# Altium schematic sheet Butterwoth_FIlter_8th_Order_Active.SchDoc
size A
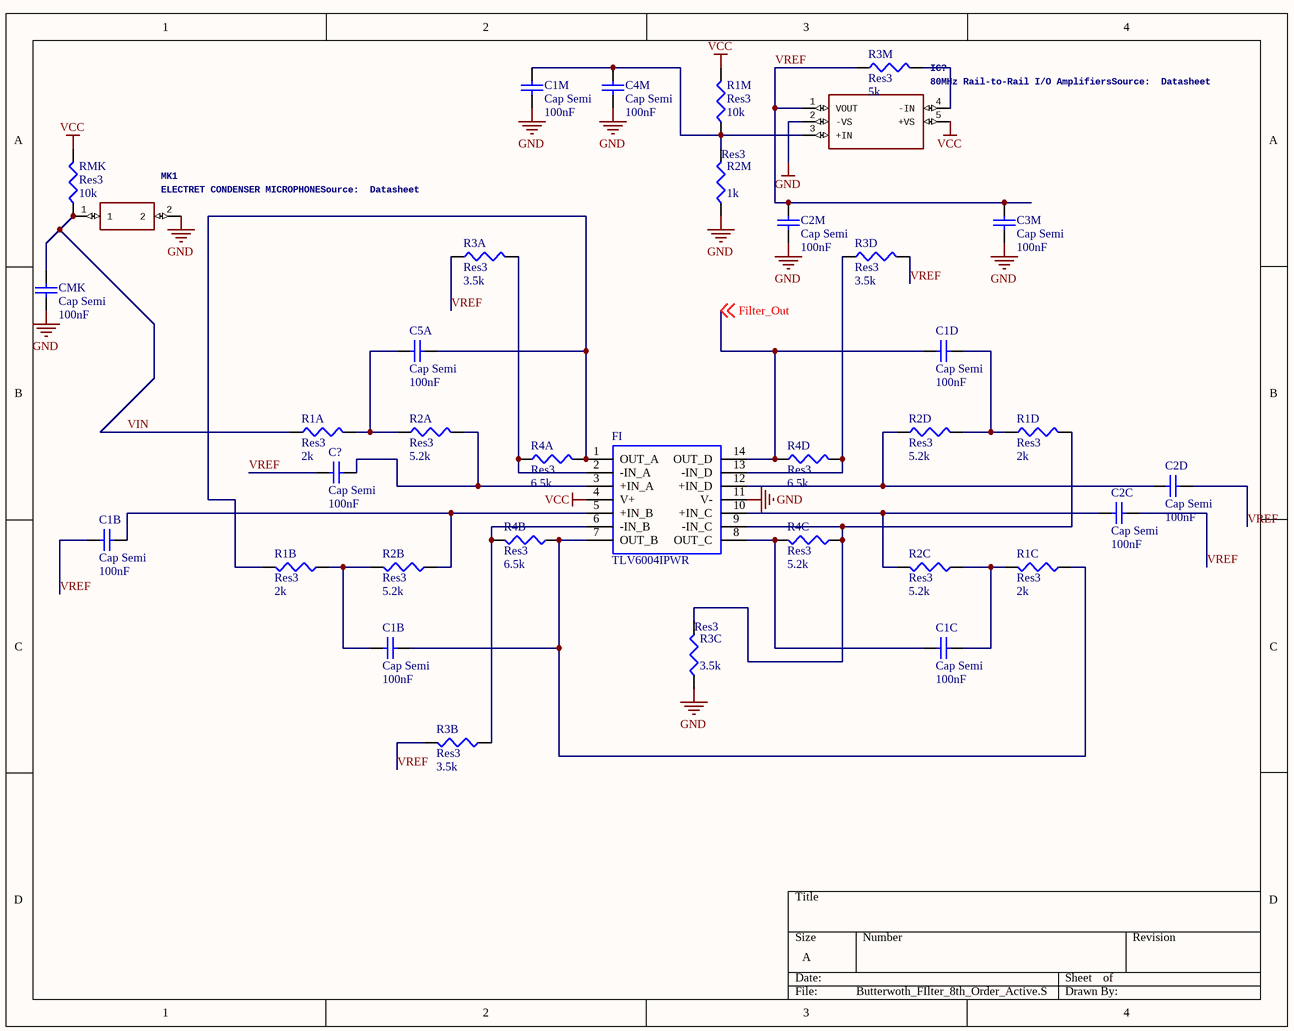
[diagram p0: Butterwoth_FIlter_8th_Order_Active.SchDoc]

## Parts
(Parts that share a designator on the sheet are numbered #1, #2 ... from top to bottom, then left to right.)
C1B#1  Cap Semi  value 100nF  [1608[0603]]
C1B#2  Cap Semi  value 100nF  [1608[0603]]
C1C  Cap Semi  value 100nF  [1608[0603]]
C1D  Cap Semi  value 100nF  [1608[0603]]
C1M  Cap Semi  value 100nF  [1608[0603]]
C2C  Cap Semi  value 100nF  [1608[0603]]
C2D  Cap Semi  value 100nF  [1608[0603]]
C2M  Cap Semi  value 100nF  [1608[0603]]
C3M  Cap Semi  value 100nF  [1608[0603]]
C4M  Cap Semi  value 100nF  [1608[0603]]
C5A  Cap Semi  value 100nF  [1608[0603]]
C?  Cap Semi  value 100nF  [1608[0603]]
CMK  Cap Semi  value 100nF  [1608[0603]]
FI  TLV6004IPWR  [SOP65P640X120-14N]
IC?  80MHz Rail-to-Rail I/O AmplifiersSource:  Datasheet  [SOT95P290X145-5N]
MK1  ELECTRET CONDENSER MICROPHONESource:  Datasheet  [CMA-4544PF-W]
R1A  Res3  value 2k  [J1-0603]
R1B  Res3  value 2k  [J1-0603]
R1C  Res3  value 2k  [J1-0603]
R1D  Res3  value 2k  [J1-0603]
R1M  Res3  value 10k  [J1-0603]
R2A  Res3  value 5.2k  [J1-0603]
R2B  Res3  value 5.2k  [J1-0603]
R2C  Res3  value 5.2k  [J1-0603]
R2D  Res3  value 5.2k  [J1-0603]
R2M  Res3  value 1k  [J1-0603]
R3A  Res3  value 3.5k  [J1-0603]
R3B  Res3  value 3.5k  [J1-0603]
R3C  Res3  value 3.5k  [J1-0603]
R3D  Res3  value 3.5k  [J1-0603]
R3M  Res3  value 5k  [J1-0603]
R4A  Res3  value 6.5k  [J1-0603]
R4B  Res3  value 6.5k  [J1-0603]
R4C  Res3  value 5.2k  [J1-0603]
R4D  Res3  value 6.5k  [J1-0603]
RMK  Res3  value 10k  [J1-0603]

## Nets
GND: C1M.1 C2M.1 C3M.1 C4M.1 CMK.1 FI.11(V-) IC?.2(-VS) MK1.2 R2M.2 R3C.2
VCC: FI.4(V+) IC?.5(+VS) R1M.1 RMK.1
Filter_Out: C1D.2 FI.14(OUT_D) R4D.2 ; off-sheet Filter_Out
VIN: CMK.2 MK1.1 R1A.1 RMK.2
VREF: C1B#1.1 C2C.2 C2D.2 C2M.2 C3M.2 C?.1 IC?.1(VOUT) R3A.1 R3B.1 R3D.1 R3M.2
NetC1B#1_2: C1B#1.2 FI.5(+IN_B) R2B.2
NetC1B#2_1: C1B#2.1 R1B.2 R2B.1
NetC1B#2_2: C1B#2.2 FI.7(OUT_B) R1C.1 R4B.2
NetC1C_1: C1C.1 R1C.2 R2C.1
NetC1C_2: C1C.2 FI.8(OUT_C) R4C.2
NetC1D_1: C1D.1 R1D.2 R2D.1
NetC1M_2: C1M.2 C4M.2 IC?.3(+IN) R1M.2 R2M.1
NetC2C_1: C2C.1 FI.10(+IN_C) R2C.2
NetC2D_1: C2D.1 FI.12(+IN_D) R2D.2
NetC5A_1: C5A.1 R1A.2 R2A.1
NetC5A_2: C5A.2 FI.1(OUT_A) R1B.1 R4A.2
NetC?_2: C?.2 FI.3(+IN_A) R2A.2
NetFI_2: FI.2(-IN_A) R3A.2 R4A.1
NetFI_6: FI.6(-IN_B) R3B.2 R4B.1
NetFI_9: FI.9(-IN_C) R1D.1 R3C.1 R4C.1
NetFI_13: FI.13(-IN_D) R3D.2 R4D.1
NetIC?_4: IC?.4(-IN) R3M.1

## Library data of the parts
C1B#1 C1B#2 C1C C1D C1M C2C C2D C2M C3M C4M C5A C? CMK = Cap Semi: Capacitor (Semiconductor SIM Model); Published: 8-Jun-2000; LatestRevisionDate: 29-May-2009; LatestRevisionNote: IPC-7351 Footprint Added.; PackageReference: C1206; Publisher: Altium Limited; PackageDescription: Chip Capacitor
FI = TLV6004IPWR: Operational Amplifiers - Op Amps 1-MHz, Low-Power Operational Amplifier for Cost-Sensitive Systems 14-TSSOP -40 to 125; Manufacturer_Name: Texas Instruments; Geometry.Height: 1.2mm; TI store Part Number: TLV6004IPWR; Manufacturer_Part_Number: TLV6004IPWR; Datasheet Link: http://www.ti.com/lit/gpn/tlv6004
IC? = AD8031ARTZ-REEL7: Manufacturer_Name: Analog Devices; GateName_1: G$1; SymbolName_1: AD8031ARTZ-REEL7; LibraryName: AD8031ARTZ-REEL7; DeviceSetName: AD8031ARTZ-REEL7; Package: SOT95P290X145-5N; Manufacturer_Part_Number: AD8031ARTZ-REEL7; Arrow_Part_Number: AD8031ARTZ-REEL7; Arrow_Price-Stock: https://www.arrow.com/en/products/ad8031artz-reel7/analog-devices; Height: mm
MK1 = CMA-4544PF-W: Manufacturer_Name: CUI; GateName_1: G$1; SymbolName_1: CMA-4544PF-W; LibraryName: CMA-4544PF-W; DeviceSetName: CMA-4544PF-W; Package: CMA-4544PF-W; Manufacturer_Part_Number: CMA-4544PF-W; Arrow_Part_Number: CMA-4544PF-W; Arrow_Price-Stock: https://www.arrow.com/en/products/cma-4544pf-w/cui-inc; Height: mm
R1A R1B R1C R1D R1M R2A R2B R2C R2D R2M R3A R3B R3C R3D R3M R4A R4B R4C R4D RMK = Res3: Resistor; Published: 8-Jun-2000; LatestRevisionDate: 29-May-2009; LatestRevisionNote: IPC-7351 Footprint Added.; PackageReference: J1-0603; Publisher: Altium Limited; PackageDescription: Chip Resistor